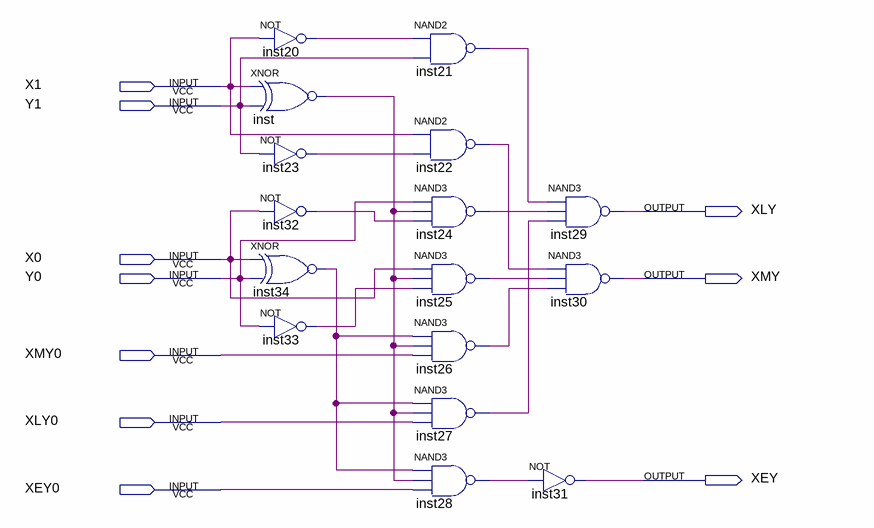
[diagram p0: schematic sheet]
// Quartus schematic point1.bdf as structural Verilog: 16 symbols, 10 pins
module point1 (
  input  X1,
  input  Y1,
  input  X0,
  input  Y0,
  input  XMY0,
  input  XLY0,
  input  XEY0,
  output XLY,
  output XMY,
  output XEY
);

  wire inst20_out, inst21_out, inst22_out, inst23_out, inst24_out, inst25_out, inst26_out, inst27_out,
       inst28_out, inst32_out, inst33_out, inst34_out, inst_out;

  xnor inst (inst_out, X1, Y1);
  xnor inst34 (inst34_out, X0, Y0);
  not inst20 (inst20_out, X1);
  not inst23 (inst23_out, Y1);
  not inst32 (inst32_out, X0);
  not inst33 (inst33_out, Y0);
  nand inst21 (inst21_out, inst20_out, Y1);
  nand inst22 (inst22_out, X1, inst23_out);
  nand inst24 (inst24_out, Y0, inst_out, inst32_out);
  nand inst25 (inst25_out, X0, inst_out, inst33_out);
  nand inst26 (inst26_out, inst34_out, inst_out, XMY0);
  nand inst27 (inst27_out, inst34_out, inst_out, XLY0);
  nand inst28 (inst28_out, inst34_out, inst_out, XEY0);
  nand inst29 (XLY, inst21_out, inst24_out, inst27_out);
  nand inst30 (XMY, inst22_out, inst25_out, inst26_out);
  not inst31 (XEY, inst28_out);
endmodule
